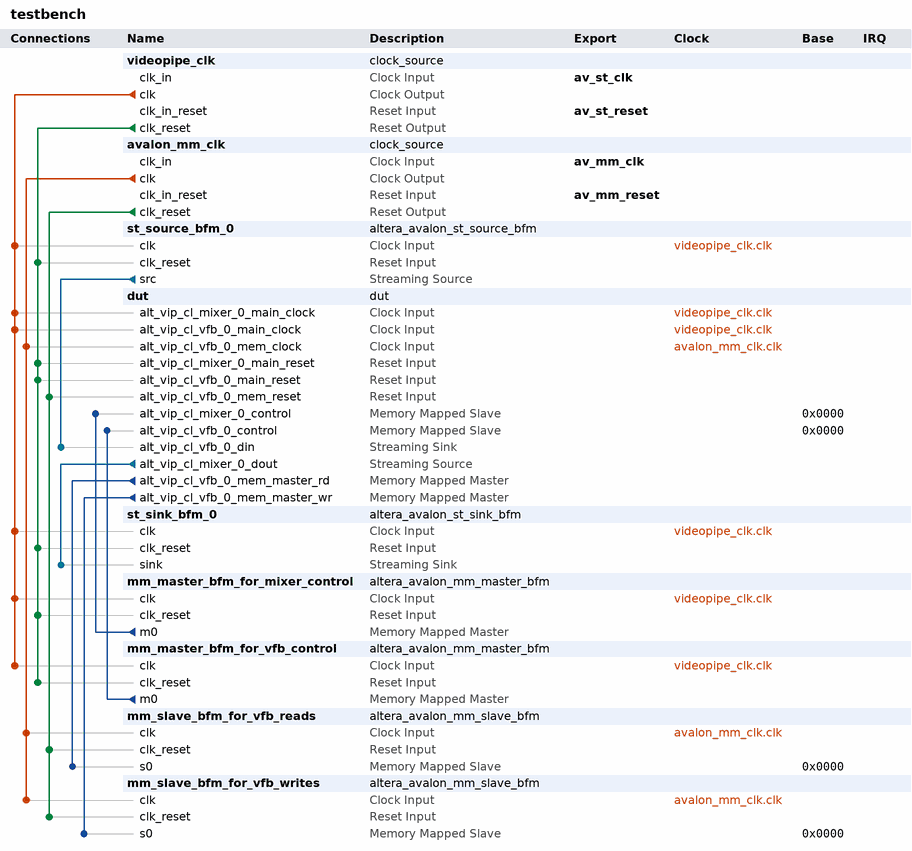
[diagram p0: system contents]
# Platform Designer (Qsys) system testbench, Cyclone V 5CEBA2F17A7
# Parameters at their usual value, and those the tool derives, are not listed.
package require -exact qsys 17.1
create_system testbench
set_project_property DEVICE_FAMILY {Cyclone V}
set_project_property DEVICE 5CEBA2F17A7

add_instance videopipe_clk clock_source 17.1
set_instance_parameter_value videopipe_clk clockFrequency 50000000

add_instance avalon_mm_clk clock_source 17.1
set_instance_parameter_value avalon_mm_clk clockFrequency 50000000

add_instance st_source_bfm_0 altera_avalon_st_source_bfm 17.1
set_instance_parameter_value st_source_bfm_0 ST_CHANNEL_W 1
set_instance_parameter_value st_source_bfm_0 ST_ERROR_W 1
set_instance_parameter_value st_source_bfm_0 ST_MAX_CHANNELS 1
set_instance_parameter_value st_source_bfm_0 ST_NUMSYMBOLS 12
set_instance_parameter_value st_source_bfm_0 ST_READY_LATENCY 1
set_instance_parameter_value st_source_bfm_0 ST_SYMBOL_W 8
set_instance_parameter_value st_source_bfm_0 USE_CHANNEL 0
set_instance_parameter_value st_source_bfm_0 USE_EMPTY 1
set_instance_parameter_value st_source_bfm_0 USE_ERROR 0
set_instance_parameter_value st_source_bfm_0 USE_PACKET 1
set_instance_parameter_value st_source_bfm_0 USE_READY 1
set_instance_parameter_value st_source_bfm_0 USE_VALID 1

add_instance dut dut 1.0

add_instance st_sink_bfm_0 altera_avalon_st_sink_bfm 17.1
set_instance_parameter_value st_sink_bfm_0 ST_CHANNEL_W 1
set_instance_parameter_value st_sink_bfm_0 ST_ERROR_W 1
set_instance_parameter_value st_sink_bfm_0 ST_MAX_CHANNELS 1
set_instance_parameter_value st_sink_bfm_0 ST_NUMSYMBOLS 12
set_instance_parameter_value st_sink_bfm_0 ST_READY_LATENCY 1
set_instance_parameter_value st_sink_bfm_0 ST_SYMBOL_W 8
set_instance_parameter_value st_sink_bfm_0 USE_CHANNEL 0
set_instance_parameter_value st_sink_bfm_0 USE_EMPTY 1
set_instance_parameter_value st_sink_bfm_0 USE_ERROR 0
set_instance_parameter_value st_sink_bfm_0 USE_PACKET 1
set_instance_parameter_value st_sink_bfm_0 USE_READY 1
set_instance_parameter_value st_sink_bfm_0 USE_VALID 1
set_instance_parameter_value st_sink_bfm_0 VHDL_ID 0

add_instance mm_master_bfm_for_mixer_control altera_avalon_mm_master_bfm 17.1
set_instance_parameter_value mm_master_bfm_for_mixer_control ADDRESS_UNITS WORDS
set_instance_parameter_value mm_master_bfm_for_mixer_control AV_ADDRESS_W 32
set_instance_parameter_value mm_master_bfm_for_mixer_control AV_ALWAYS_BURST_MAX_BURST 0
set_instance_parameter_value mm_master_bfm_for_mixer_control AV_BURSTCOUNT_W 3
set_instance_parameter_value mm_master_bfm_for_mixer_control AV_BURST_BNDR_ONLY 1
set_instance_parameter_value mm_master_bfm_for_mixer_control AV_BURST_LINEWRAP 1
set_instance_parameter_value mm_master_bfm_for_mixer_control AV_CONSTANT_BURST_BEHAVIOR 1
set_instance_parameter_value mm_master_bfm_for_mixer_control AV_FIX_READ_LATENCY 1
set_instance_parameter_value mm_master_bfm_for_mixer_control AV_MAX_PENDING_WRITES 0
set_instance_parameter_value mm_master_bfm_for_mixer_control AV_NUMSYMBOLS 4
set_instance_parameter_value mm_master_bfm_for_mixer_control AV_READRESPONSE_W 8
set_instance_parameter_value mm_master_bfm_for_mixer_control AV_READ_WAIT_TIME 1
set_instance_parameter_value mm_master_bfm_for_mixer_control AV_WRITERESPONSE_W 8
set_instance_parameter_value mm_master_bfm_for_mixer_control USE_BURSTCOUNT 1
set_instance_parameter_value mm_master_bfm_for_mixer_control USE_BYTE_ENABLE 1
set_instance_parameter_value mm_master_bfm_for_mixer_control USE_READ 1
set_instance_parameter_value mm_master_bfm_for_mixer_control USE_READ_DATA 1
set_instance_parameter_value mm_master_bfm_for_mixer_control USE_READ_DATA_VALID 1
set_instance_parameter_value mm_master_bfm_for_mixer_control USE_WAIT_REQUEST 1
set_instance_parameter_value mm_master_bfm_for_mixer_control VHDL_ID 0

add_instance mm_master_bfm_for_vfb_control altera_avalon_mm_master_bfm 17.1
set_instance_parameter_value mm_master_bfm_for_vfb_control ADDRESS_UNITS WORDS
set_instance_parameter_value mm_master_bfm_for_vfb_control AV_ADDRESS_W 32
set_instance_parameter_value mm_master_bfm_for_vfb_control AV_ALWAYS_BURST_MAX_BURST 0
set_instance_parameter_value mm_master_bfm_for_vfb_control AV_BURSTCOUNT_W 3
set_instance_parameter_value mm_master_bfm_for_vfb_control AV_BURST_BNDR_ONLY 1
set_instance_parameter_value mm_master_bfm_for_vfb_control AV_BURST_LINEWRAP 1
set_instance_parameter_value mm_master_bfm_for_vfb_control AV_CONSTANT_BURST_BEHAVIOR 1
set_instance_parameter_value mm_master_bfm_for_vfb_control AV_FIX_READ_LATENCY 1
set_instance_parameter_value mm_master_bfm_for_vfb_control AV_MAX_PENDING_WRITES 0
set_instance_parameter_value mm_master_bfm_for_vfb_control AV_NUMSYMBOLS 4
set_instance_parameter_value mm_master_bfm_for_vfb_control AV_READRESPONSE_W 8
set_instance_parameter_value mm_master_bfm_for_vfb_control AV_READ_WAIT_TIME 1
set_instance_parameter_value mm_master_bfm_for_vfb_control AV_WRITERESPONSE_W 8
set_instance_parameter_value mm_master_bfm_for_vfb_control USE_BURSTCOUNT 1
set_instance_parameter_value mm_master_bfm_for_vfb_control USE_BYTE_ENABLE 1
set_instance_parameter_value mm_master_bfm_for_vfb_control USE_READ 1
set_instance_parameter_value mm_master_bfm_for_vfb_control USE_READ_DATA 1
set_instance_parameter_value mm_master_bfm_for_vfb_control USE_READ_DATA_VALID 1
set_instance_parameter_value mm_master_bfm_for_vfb_control USE_WAIT_REQUEST 1
set_instance_parameter_value mm_master_bfm_for_vfb_control VHDL_ID 0

add_instance mm_slave_bfm_for_vfb_reads altera_avalon_mm_slave_bfm 17.1
set_instance_parameter_value mm_slave_bfm_for_vfb_reads ADDRESS_UNITS SYMBOLS
set_instance_parameter_value mm_slave_bfm_for_vfb_reads ASSERT_HIGH_ARBITERLOCK 1
set_instance_parameter_value mm_slave_bfm_for_vfb_reads ASSERT_HIGH_BYTEENABLE 1
set_instance_parameter_value mm_slave_bfm_for_vfb_reads ASSERT_HIGH_LOCK 1
set_instance_parameter_value mm_slave_bfm_for_vfb_reads ASSERT_HIGH_READ 1
set_instance_parameter_value mm_slave_bfm_for_vfb_reads ASSERT_HIGH_READDATAVALID 1
set_instance_parameter_value mm_slave_bfm_for_vfb_reads ASSERT_HIGH_RESET 1
set_instance_parameter_value mm_slave_bfm_for_vfb_reads ASSERT_HIGH_WAITREQUEST 1
set_instance_parameter_value mm_slave_bfm_for_vfb_reads ASSERT_HIGH_WRITE 1
set_instance_parameter_value mm_slave_bfm_for_vfb_reads AV_ADDRESS_W 32
set_instance_parameter_value mm_slave_bfm_for_vfb_reads AV_BURSTCOUNT_W 5
set_instance_parameter_value mm_slave_bfm_for_vfb_reads AV_BURST_BNDR_ONLY 1
set_instance_parameter_value mm_slave_bfm_for_vfb_reads AV_BURST_LINEWRAP 0
set_instance_parameter_value mm_slave_bfm_for_vfb_reads AV_FIX_READ_LATENCY 0
set_instance_parameter_value mm_slave_bfm_for_vfb_reads AV_MAX_PENDING_READS 64
set_instance_parameter_value mm_slave_bfm_for_vfb_reads AV_MAX_PENDING_WRITES 0
set_instance_parameter_value mm_slave_bfm_for_vfb_reads AV_NUMSYMBOLS 16
set_instance_parameter_value mm_slave_bfm_for_vfb_reads AV_READRESPONSE_W 8
set_instance_parameter_value mm_slave_bfm_for_vfb_reads AV_READ_WAIT_TIME 1
set_instance_parameter_value mm_slave_bfm_for_vfb_reads AV_REGISTERINCOMINGSIGNALS 0
set_instance_parameter_value mm_slave_bfm_for_vfb_reads AV_SYMBOL_W 8
set_instance_parameter_value mm_slave_bfm_for_vfb_reads AV_WRITERESPONSE_W 8
set_instance_parameter_value mm_slave_bfm_for_vfb_reads AV_WRITE_WAIT_TIME 0
set_instance_parameter_value mm_slave_bfm_for_vfb_reads REGISTER_WAITREQUEST 0
set_instance_parameter_value mm_slave_bfm_for_vfb_reads USE_ADDRESS 1
set_instance_parameter_value mm_slave_bfm_for_vfb_reads USE_ARBITERLOCK 0
set_instance_parameter_value mm_slave_bfm_for_vfb_reads USE_BEGIN_BURST_TRANSFER 0
set_instance_parameter_value mm_slave_bfm_for_vfb_reads USE_BEGIN_TRANSFER 0
set_instance_parameter_value mm_slave_bfm_for_vfb_reads USE_BURSTCOUNT 1
set_instance_parameter_value mm_slave_bfm_for_vfb_reads USE_BYTE_ENABLE 1
set_instance_parameter_value mm_slave_bfm_for_vfb_reads USE_CLKEN 0
set_instance_parameter_value mm_slave_bfm_for_vfb_reads USE_DEBUGACCESS 0
set_instance_parameter_value mm_slave_bfm_for_vfb_reads USE_LOCK 0
set_instance_parameter_value mm_slave_bfm_for_vfb_reads USE_READ 1
set_instance_parameter_value mm_slave_bfm_for_vfb_reads USE_READRESPONSE 0
set_instance_parameter_value mm_slave_bfm_for_vfb_reads USE_READ_DATA 1
set_instance_parameter_value mm_slave_bfm_for_vfb_reads USE_READ_DATA_VALID 1
set_instance_parameter_value mm_slave_bfm_for_vfb_reads USE_TRANSACTIONID 0
set_instance_parameter_value mm_slave_bfm_for_vfb_reads USE_WAIT_REQUEST 1
set_instance_parameter_value mm_slave_bfm_for_vfb_reads USE_WRITE 1
set_instance_parameter_value mm_slave_bfm_for_vfb_reads USE_WRITERESPONSE 0
set_instance_parameter_value mm_slave_bfm_for_vfb_reads USE_WRITE_DATA 1
set_instance_parameter_value mm_slave_bfm_for_vfb_reads VHDL_ID 0

add_instance mm_slave_bfm_for_vfb_writes altera_avalon_mm_slave_bfm 17.1
set_instance_parameter_value mm_slave_bfm_for_vfb_writes ADDRESS_UNITS SYMBOLS
set_instance_parameter_value mm_slave_bfm_for_vfb_writes ASSERT_HIGH_ARBITERLOCK 1
set_instance_parameter_value mm_slave_bfm_for_vfb_writes ASSERT_HIGH_BYTEENABLE 1
set_instance_parameter_value mm_slave_bfm_for_vfb_writes ASSERT_HIGH_LOCK 1
set_instance_parameter_value mm_slave_bfm_for_vfb_writes ASSERT_HIGH_READ 1
set_instance_parameter_value mm_slave_bfm_for_vfb_writes ASSERT_HIGH_READDATAVALID 1
set_instance_parameter_value mm_slave_bfm_for_vfb_writes ASSERT_HIGH_RESET 1
set_instance_parameter_value mm_slave_bfm_for_vfb_writes ASSERT_HIGH_WAITREQUEST 1
set_instance_parameter_value mm_slave_bfm_for_vfb_writes ASSERT_HIGH_WRITE 1
set_instance_parameter_value mm_slave_bfm_for_vfb_writes AV_ADDRESS_W 32
set_instance_parameter_value mm_slave_bfm_for_vfb_writes AV_BURSTCOUNT_W 5
set_instance_parameter_value mm_slave_bfm_for_vfb_writes AV_BURST_BNDR_ONLY 1
set_instance_parameter_value mm_slave_bfm_for_vfb_writes AV_BURST_LINEWRAP 0
set_instance_parameter_value mm_slave_bfm_for_vfb_writes AV_FIX_READ_LATENCY 0
set_instance_parameter_value mm_slave_bfm_for_vfb_writes AV_MAX_PENDING_READS 64
set_instance_parameter_value mm_slave_bfm_for_vfb_writes AV_MAX_PENDING_WRITES 0
set_instance_parameter_value mm_slave_bfm_for_vfb_writes AV_NUMSYMBOLS 16
set_instance_parameter_value mm_slave_bfm_for_vfb_writes AV_READRESPONSE_W 8
set_instance_parameter_value mm_slave_bfm_for_vfb_writes AV_READ_WAIT_TIME 1
set_instance_parameter_value mm_slave_bfm_for_vfb_writes AV_REGISTERINCOMINGSIGNALS 0
set_instance_parameter_value mm_slave_bfm_for_vfb_writes AV_SYMBOL_W 8
set_instance_parameter_value mm_slave_bfm_for_vfb_writes AV_WRITERESPONSE_W 8
set_instance_parameter_value mm_slave_bfm_for_vfb_writes AV_WRITE_WAIT_TIME 0
set_instance_parameter_value mm_slave_bfm_for_vfb_writes REGISTER_WAITREQUEST 0
set_instance_parameter_value mm_slave_bfm_for_vfb_writes USE_ADDRESS 1
set_instance_parameter_value mm_slave_bfm_for_vfb_writes USE_ARBITERLOCK 0
set_instance_parameter_value mm_slave_bfm_for_vfb_writes USE_BEGIN_BURST_TRANSFER 0
set_instance_parameter_value mm_slave_bfm_for_vfb_writes USE_BEGIN_TRANSFER 0
set_instance_parameter_value mm_slave_bfm_for_vfb_writes USE_BURSTCOUNT 1
set_instance_parameter_value mm_slave_bfm_for_vfb_writes USE_BYTE_ENABLE 1
set_instance_parameter_value mm_slave_bfm_for_vfb_writes USE_CLKEN 0
set_instance_parameter_value mm_slave_bfm_for_vfb_writes USE_DEBUGACCESS 0
set_instance_parameter_value mm_slave_bfm_for_vfb_writes USE_LOCK 0
set_instance_parameter_value mm_slave_bfm_for_vfb_writes USE_READ 1
set_instance_parameter_value mm_slave_bfm_for_vfb_writes USE_READRESPONSE 0
set_instance_parameter_value mm_slave_bfm_for_vfb_writes USE_READ_DATA 1
set_instance_parameter_value mm_slave_bfm_for_vfb_writes USE_READ_DATA_VALID 1
set_instance_parameter_value mm_slave_bfm_for_vfb_writes USE_TRANSACTIONID 0
set_instance_parameter_value mm_slave_bfm_for_vfb_writes USE_WAIT_REQUEST 1
set_instance_parameter_value mm_slave_bfm_for_vfb_writes USE_WRITE 1
set_instance_parameter_value mm_slave_bfm_for_vfb_writes USE_WRITERESPONSE 0
set_instance_parameter_value mm_slave_bfm_for_vfb_writes USE_WRITE_DATA 1
set_instance_parameter_value mm_slave_bfm_for_vfb_writes VHDL_ID 0

# connections
add_connection avalon_mm_clk.clk dut.alt_vip_cl_vfb_0_mem_clock clock
add_connection avalon_mm_clk.clk mm_slave_bfm_for_vfb_reads.clk clock
add_connection avalon_mm_clk.clk mm_slave_bfm_for_vfb_writes.clk clock
add_connection videopipe_clk.clk dut.alt_vip_cl_mixer_0_main_clock clock
add_connection videopipe_clk.clk dut.alt_vip_cl_vfb_0_main_clock clock
add_connection videopipe_clk.clk mm_master_bfm_for_mixer_control.clk clock
add_connection videopipe_clk.clk mm_master_bfm_for_vfb_control.clk clock
add_connection videopipe_clk.clk st_sink_bfm_0.clk clock
add_connection videopipe_clk.clk st_source_bfm_0.clk clock
add_connection avalon_mm_clk.clk_reset dut.alt_vip_cl_vfb_0_mem_reset reset
add_connection avalon_mm_clk.clk_reset mm_slave_bfm_for_vfb_reads.clk_reset reset
add_connection avalon_mm_clk.clk_reset mm_slave_bfm_for_vfb_writes.clk_reset reset
add_connection videopipe_clk.clk_reset dut.alt_vip_cl_mixer_0_main_reset reset
add_connection videopipe_clk.clk_reset dut.alt_vip_cl_vfb_0_main_reset reset
add_connection videopipe_clk.clk_reset mm_master_bfm_for_mixer_control.clk_reset reset
add_connection videopipe_clk.clk_reset mm_master_bfm_for_vfb_control.clk_reset reset
add_connection videopipe_clk.clk_reset st_sink_bfm_0.clk_reset reset
add_connection videopipe_clk.clk_reset st_source_bfm_0.clk_reset reset
add_connection dut.alt_vip_cl_vfb_0_mem_master_rd mm_slave_bfm_for_vfb_reads.s0 avalon
set_connection_parameter_value dut.alt_vip_cl_vfb_0_mem_master_rd/mm_slave_bfm_for_vfb_reads.s0 baseAddress 0x0000
add_connection dut.alt_vip_cl_vfb_0_mem_master_wr mm_slave_bfm_for_vfb_writes.s0 avalon
set_connection_parameter_value dut.alt_vip_cl_vfb_0_mem_master_wr/mm_slave_bfm_for_vfb_writes.s0 baseAddress 0x0000
add_connection mm_master_bfm_for_mixer_control.m0 dut.alt_vip_cl_mixer_0_control avalon
set_connection_parameter_value mm_master_bfm_for_mixer_control.m0/dut.alt_vip_cl_mixer_0_control baseAddress 0x0000
add_connection mm_master_bfm_for_vfb_control.m0 dut.alt_vip_cl_vfb_0_control avalon
set_connection_parameter_value mm_master_bfm_for_vfb_control.m0/dut.alt_vip_cl_vfb_0_control baseAddress 0x0000
add_connection dut.alt_vip_cl_mixer_0_dout st_sink_bfm_0.sink avalon_streaming
add_connection st_source_bfm_0.src dut.alt_vip_cl_vfb_0_din avalon_streaming

# exported interfaces
add_interface av_mm_clk clock sink
set_interface_property av_mm_clk EXPORT_OF avalon_mm_clk.clk_in
add_interface av_mm_reset reset sink
set_interface_property av_mm_reset EXPORT_OF avalon_mm_clk.clk_in_reset
add_interface av_st_clk clock sink
set_interface_property av_st_clk EXPORT_OF videopipe_clk.clk_in
add_interface av_st_reset reset sink
set_interface_property av_st_reset EXPORT_OF videopipe_clk.clk_in_reset

set_interconnect_requirement {$system} qsys_mm.clockCrossingAdapter HANDSHAKE
set_interconnect_requirement {$system} qsys_mm.enableEccProtection FALSE
set_interconnect_requirement {$system} qsys_mm.insertDefaultSlave FALSE
set_interconnect_requirement {$system} qsys_mm.maxAdditionalLatency 1

save_system testbench.qsys
